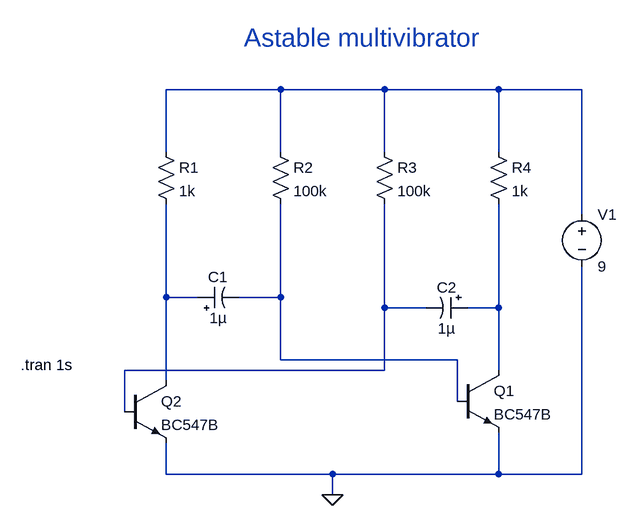
[diagram p0: schematic Astable-multivibrator.asc]
Astable-multivibrator.asc, the LTspice schematic file:
Version 4
SHEET 1 1088 680
WIRE 16 -144 -160 -144
WIRE 176 -144 16 -144
WIRE 352 -144 176 -144
WIRE 480 -144 352 -144
WIRE -160 -48 -160 -144
WIRE 16 -48 16 -144
WIRE 176 -48 176 -144
WIRE 352 -48 352 -144
WIRE 480 48 480 -144
WIRE -160 176 -160 32
WIRE -112 176 -160 176
WIRE 16 176 16 32
WIRE 16 176 -48 176
WIRE 176 192 176 32
WIRE 240 192 176 192
WIRE 352 192 352 32
WIRE 352 192 304 192
WIRE 16 272 16 176
WIRE 288 272 16 272
WIRE 176 288 176 192
WIRE 176 288 -224 288
WIRE 352 288 352 192
WIRE -160 304 -160 176
WIRE 288 336 288 272
WIRE -224 352 -224 288
WIRE -160 448 -160 400
WIRE 96 448 -160 448
WIRE 352 448 352 384
WIRE 352 448 96 448
WIRE 480 448 480 128
WIRE 480 448 352 448
WIRE 96 480 96 448
FLAG 96 480 0
SYMBOL res -176 -64 R0
SYMATTR InstName R1
SYMATTR Value 1k
SYMBOL res 0 -64 R0
SYMATTR InstName R2
SYMATTR Value 100k
SYMBOL res 160 -64 R0
SYMATTR InstName R3
SYMATTR Value 100k
SYMBOL res 336 -64 R0
SYMATTR InstName R4
SYMATTR Value 1k
SYMBOL npn 288 288 R0
SYMATTR InstName Q1
SYMATTR Value BC547B
SYMBOL npn -224 304 R0
SYMATTR InstName Q2
SYMATTR Value BC547B
SYMBOL voltage 480 32 R0
WINDOW 123 0 0 Left 2
WINDOW 39 0 0 Left 2
SYMATTR InstName V1
SYMATTR Value 9
SYMBOL polcap -112 192 R270
WINDOW 0 32 32 VTop 2
WINDOW 3 0 32 VBottom 2
SYMATTR InstName C1
SYMATTR Value 1µ
SYMBOL polcap 304 176 R90
WINDOW 0 0 32 VBottom 2
WINDOW 3 32 32 VTop 2
SYMATTR InstName C2
SYMATTR Value 1µ
TEXT -384 280 Left 2 !.tran 1s
TEXT -40 -224 Left 4 ;Astable multivibrator

The netlist it stands for:
* Astable-multivibrator.asc
R1 N001 N002 1k
R2 N001 N003 100k
R3 N001 N004 100k
R4 N001 N005 1k
Q1 N005 N003 0 0 BC547B
Q2 N002 N004 0 0 BC547B
V1 N001 0 9
C1 N002 N003 1µ
C2 N005 N004 1µ
.model NPN NPN
.model PNP PNP
.lib standard.bjt
.tran 1s
* Astable multivibrator
.backanno
.end